# EasyEDA schematic RGB.json
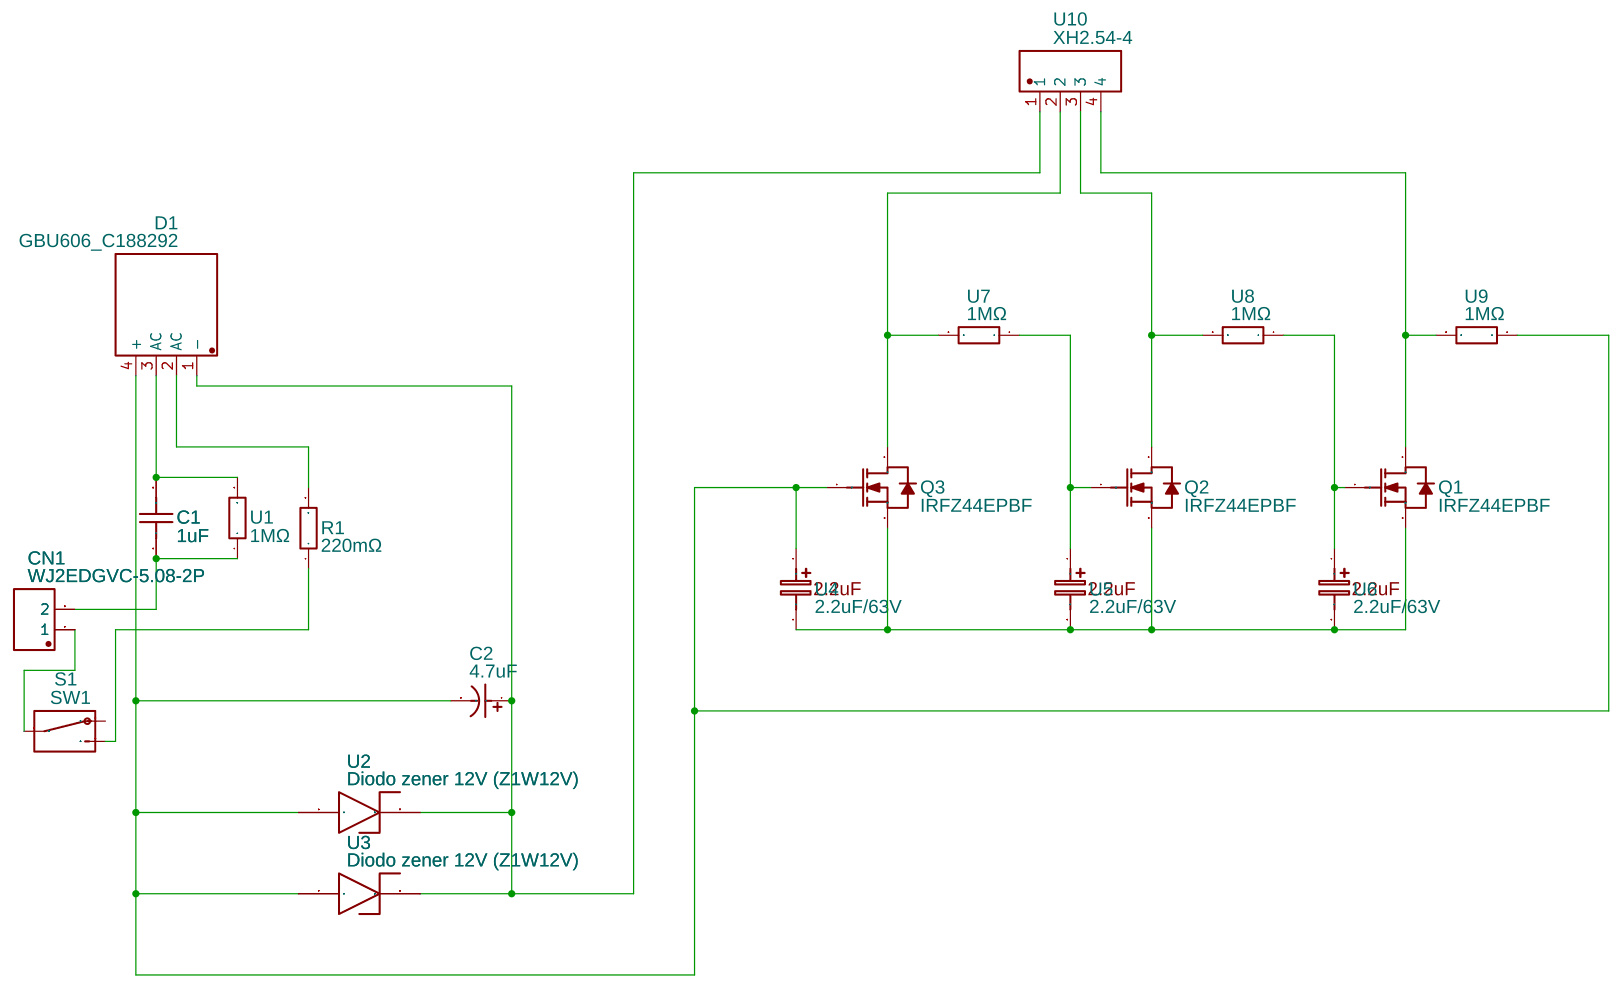
[diagram p0: schematic sheet]

## Parts
C1  1uF  [CAP-TH_L12.0-W12.5-P10.00-D0.6]
C2  4.7uF  [CAP-TH_BD10.0-P5.00-D1.0-FD]
CN1  WJ2EDGVC-5.08-2P  [CONN-TH_WJ2EDGVC-5.08-2P]
D1  GBU606_C188292  [DIO-BG-TH_GBU]
Q1  IRFZ44EPBF  [TO-220AB-3_L10.4-W4.5-P2.54-L]
Q2  IRFZ44EPBF  [TO-220AB-3_L10.4-W4.5-P2.54-L]
Q3  IRFZ44EPBF  [TO-220AB-3_L10.4-W4.5-P2.54-L]
R1  220mΩ  [RES-TH_BD9.5-L22.0-P28.00-D1.0]
S1  SW1  [SW-TH_G-SWITCH_SS-12F30-G040]
U1  1MΩ  [RES-TH_BD2.4-L6.3-P10.30-D0.6]
U2  Diodo zener 12V (Z1W12V)  [DIODO ZENER 12V (Z1W12V)]
U3  Diodo zener 12V (Z1W12V)  [DIODO ZENER 12V (Z1W12V)]
U4  2.2uF/63V  [2.2UF/63V]
U5  2.2uF/63V  [2.2UF/63V]
U6  2.2uF/63V  [2.2UF/63V]
U7  1MΩ  [RES-TH_BD2.4-L6.3-P10.30-D0.6]
U8  1MΩ  [RES-TH_BD2.4-L6.3-P10.30-D0.6]
U9  1MΩ  [RES-TH_BD2.4-L6.3-P10.30-D0.6]
U10  XH2.54-4  [CONN-TH_XH2.54-4]

## Library data of the parts
C1 = CBB22-105J-520V: Contributor: lcsc; Supplier: LCSC; Supplier Part: C914537; Manufacturer: NDF(达孚); JLCPCB Part Class: Extended Part
C2 = 4.7uF 400V: Supplier: LCSC; Manufacturer: CX(承兴); Manufacturer Part: KM475M400G13RR0VH2FP0; Supplier Part: C21530; JLCPCB Part Class: Extended Part
CN1 = WJ2EDGVC-5.08-2P: Supplier: LCSC; Manufacturer: KANGNEX(康奈克斯电气); Supplier Part: C8445; JLCPCB Part Class: Extended Part
D1 = GBU606_C188292: Contributor: LCSC; Supplier: LCSC; Supplier Part: C188292; Manufacturer: FMS(美丽微); Manufacturer Part: GBU606; JLCPCB Part Class: Extended Part
Q1-Q3 = IRFZ44EPBF: Contributor: LCSC; Supplier: LCSC; Supplier Part: C538074; Manufacturer: Infineon(英飞凌); JLCPCB Part Class: Extended Part
R1 = CR-L5W0.22ΩJ: Contributor: LCSC; Supplier: LCSC; Supplier Part: C216399; Manufacturer: CCO(千志电子); Manufacturer Part: CR-L5W0.22Ω 5% P; JLCPCB Part Class: Extended Part
S1 = SW1: Contributor: Raul Hejja
U1 U7-U9 = FMP100FRE52-1M: Contributor: lcsc; Supplier: LCSC; Supplier Part: C1756033; Manufacturer: YAGEO(国巨)
U2 U3 = Diodo zener 12V (Z1W12V): Contributor: xavierci22
U4-U6 = 2.2uF/63V: Contributor: R.M.Venkatraj
U10 = XH2.54-4: Contributor: LCSC; Supplier: LCSC; Supplier Part: C9900012082; Manufacturer: null; JLCPCB Part Class: Extended Part

## Nets
Net-(C1-1): C1.1 CN1.2 U1.1
Net-(C1-2): C1.2 D1.3(AC) U1.2
Net-(C2-1): C2.1 D1.1(-) U2.2 U3.2 U10.1
Net-(C2-2): C2.2 D1.4(+) Q3.1(G) U2.1 U3.1 U4.1 U9.1
Net-(CN1-1): CN1.1 S1.2(P)
Net-(D1-2): D1.2(AC) R1.2
Net-(Q1-1): Q1.1(G) U6.1 U8.1
Net-(Q1-2): Q1.2(D) U9.2 U10.4
Net-(Q1-3): Q1.3(S) Q2.3(S) Q3.3(S) U4.2 U5.2 U6.2
Net-(Q2-1): Q2.1(G) U5.1 U7.1
Net-(Q2-2): Q2.2(D) U8.2 U10.3
Net-(Q3-2): Q3.2(D) U7.2 U10.2
Net-(R1-1): R1.1 S1.3(S)

Not connected (* = marked no-connect by the designer): S1 1(O)
